# Altium project DriverBoard.PrjPcb
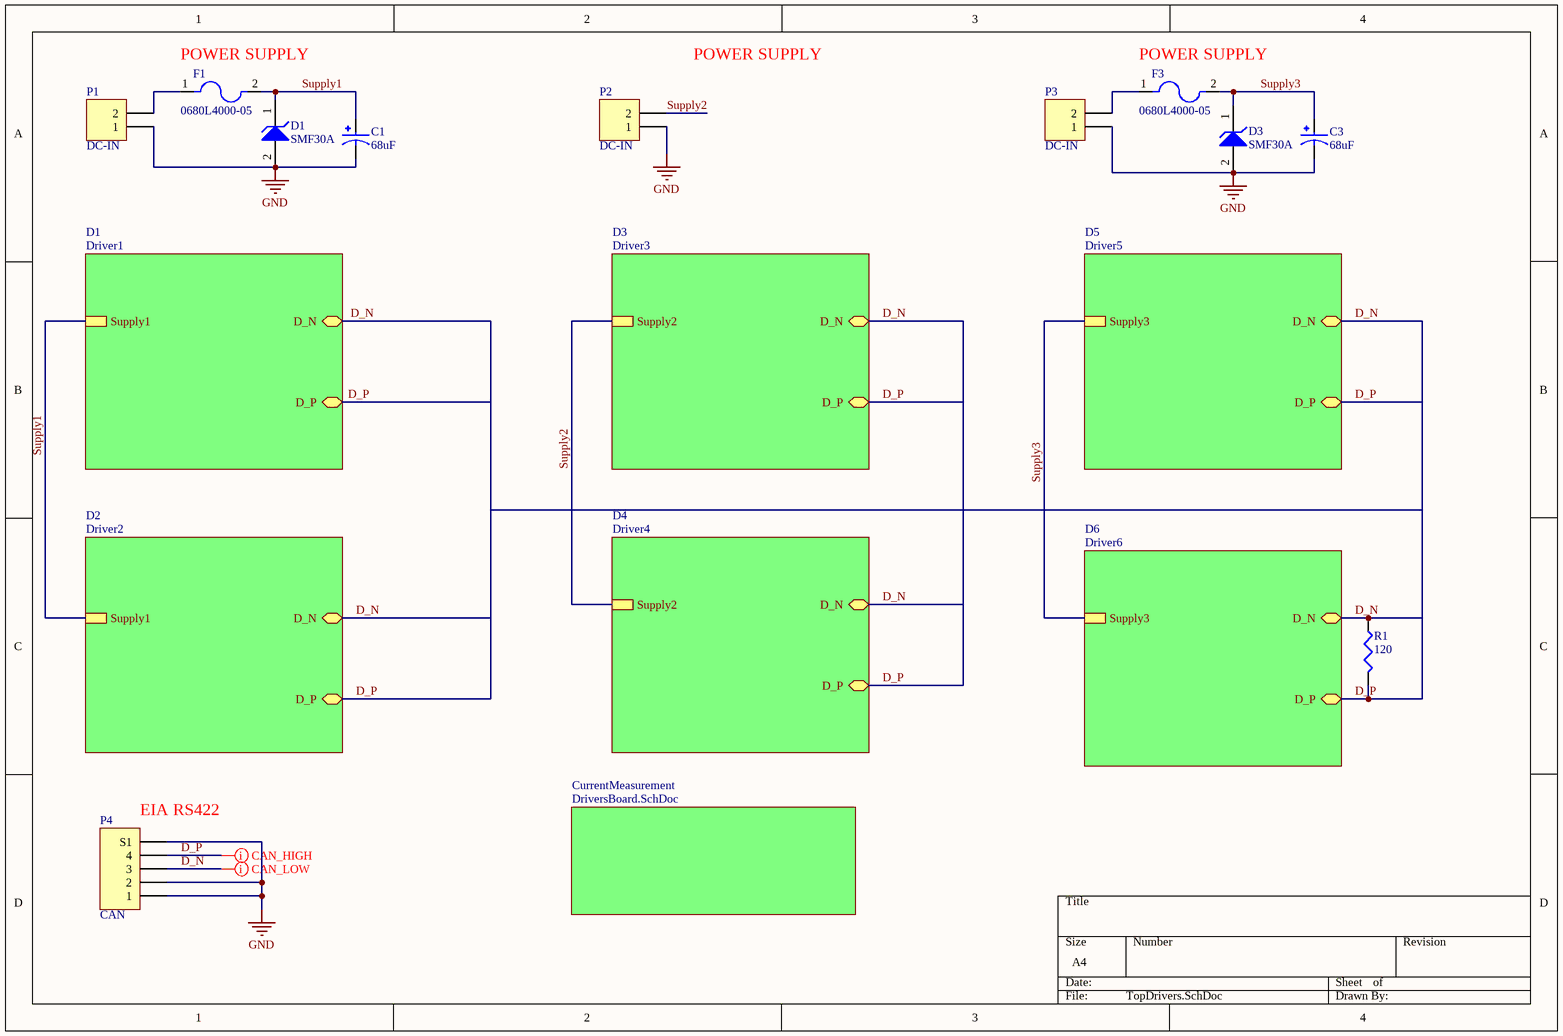
[diagram p0: TopDrivers.SchDoc]
8 sheets, 175 parts. Net scope: hierarchical (ports join the sheet entries above them; power ports are global).
Board files: DriversBoard_Bigger.PcbDoc, PCB1.PcbDoc, DriversBoard.PcbDoc
Sheets:
  TopDrivers.SchDoc
    CurrentMeasurement = DriversBoard.SchDoc
    D1 = Driver1.SchDoc
    D3 = Driver3.SchDoc
    D5 = Driver5.SchDoc
    D2 = Driver2.SchDoc
    D4 = Driver4.SchDoc
    D6 = Driver6.SchDoc

## Sheet TopDrivers.SchDoc
size A4; SheetNumber: 1; SheetTotal: 8

### Parts
C1  68uF  [CAP_50SVT68M]
C3  68uF  [CAP_50SVT68M]
D1  SMF30A  [ONSC-SOD-123FL-2-498_V]
D3  SMF30A  [ONSC-SOD-123FL-2-498_V]
F1  0680L4000-05  [FUSC6125X279N]
F3  0680L4000-05  [FUSC6125X279N]
P1  DC-IN  [MOLEX_1724480002]
P2  DC-IN  [MOLEX_1724480002]
P3  DC-IN  [MOLEX_1724480002]
P4  CAN  [MOLEX_5025850470]
R1  value 120  [J1-0603]  (hidden comment: Res3)

### Sub-sheets
CurrentMeasurement = DriversBoard.SchDoc: no entries
D1 = Driver1: Supply1, D_P (bidir), D_N (bidir)
D2 = Driver2: D_P (bidir), D_N (bidir), Supply1
D3 = Driver3: D_P (bidir), D_N (bidir), Supply2
D4 = Driver4: D_P (bidir), D_N (bidir), Supply2
D5 = Driver5: D_N (bidir), D_P (bidir), Supply3
D6 = Driver6: D_N (bidir), D_P (bidir), Supply3

### Nets
GND: C1.2 C3.2 D1.2(A) D3.2(A) P1.1 P2.1 P3.1 P4.1 P4.2 P4.S1
Supply1: C1.1 D1.1(K) F1.2 ; sheet D1/Supply1, sheet D2/Supply1
D_N: P4.3 R1.1 ; sheet D1/D_N, sheet D3/D_N, sheet D5/D_N, sheet D2/D_N, sheet D4/D_N, sheet D6/D_N
D_P: P4.4 R1.2 ; sheet D1/D_P, sheet D3/D_P, sheet D5/D_P, sheet D2/D_P, sheet D4/D_P, sheet D6/D_P
Supply2: P2.2 ; sheet D3/Supply2, sheet D4/Supply2
Supply3: C3.1 D3.1(K) F3.2 ; sheet D5/Supply3, sheet D6/Supply3
NetF1_1: F1.1 P1.2
NetF3_1: F3.1 P3.2

### Layout directives
differential pair; differential pair class *; net class *: D_N
differential pair: D_P

### Notes on the sheet
- (near F1) POWER SUPPLY
- POWER SUPPLY
- (near F3) POWER SUPPLY
- (near P4) EIA RS422

### Library data of the parts
C1 C3 = 50SVT68M: Package: None; MP: 50SVT68M; Price: None; Availability: Unavailable; Value: *
D1 D3 = SMF30AT1G: 200 W Transient Voltage Suppressor, 2-Pin SOD-123FL, Pb-Free, Tape and Reel; Manufacturer: On Semiconductor; Direction: Unidirectional; IR Max (uA): 1; V(BR) Typ (V): 35.1; DatasheetVersion: Rev. 7; PackageVersion: Rev. D, 05/2013; PackageReference: SOD-123FL-2-498; PackageDescription: 2-Pin SOD, Body 1.65 x 2.7 mm; Supplier 1: Digi-Key; Supplier Part Number 1: SMF30AT1GOSTR-ND; Supplier 2: Digi-Key; Supplier Part Number 2: SMF30AT1GOSCT-ND; Supplier 3: Digi-Key; Supplier Part Number 3: SMF30AT1GOSDKR-ND; Supplier 4: Farnell; Supplier Part Number 4: 2317489; Supplier 5: Newark; Supplier Part Number 5: 09R9720; Supplier 6: Newark; Supplier Part Number 6: 42K2628; Supplier 7: Mouser; Supplier Part Number 7: 863-SMF30AT1G; Packing: Tape and Reel; RoHS: Pb-Free; Mounting Technology: Surface Mount; PartNumber: SMF30AT1G; ComponentLink1Description: Manufacturer URL; ComponentLink1URL: http://www.onsemi.com/; ComponentLink2Description: Datasheet; ComponentLink2URL: http://www.onsemi.com/pub_link/Collateral/SMF5.0AT1-D.PDF; ComponentLink3Description: Package Specification; ComponentLink3URL: http://www.onsemi.com/pub_link/Collateral/498-01.PDF
F1 F3 = 0680L4000-05: Surface mount bricks | Silver Plated | 2410 case size | Slow Blow | 4A | Tape and Reel (5000 pcs.); MF: Bel Fuse; SnapEDA_Link: https://www.snapeda.com/parts/0680L4000-05/Bel+Fuse/view-part/?ref=snap; Purchase-URL: https://pricing.snapeda.com/search/part/0680L4000-05/?ref=eda; Availability: In Stock; MP: 0680L4000-05; Value: *; Price: None; Package: SMD-2 Bel Fuse Inc.; Check_prices: https://www.snapeda.com/parts/0680L4000-05/Bel+Fuse/view-part/?ref=eda
P1-P3 = Header 2: Header, 2-Pin; LatestRevisionDate: 17-Jul-2002; LatestRevisionNote: Re-released for DXP Platform.; Publisher: Altium Limited
P4 = Header 5: Header, 5-Pin; LatestRevisionDate: 17-Jul-2002; LatestRevisionNote: Re-released for DXP Platform.; Publisher: Altium Limited; Part Number: *
R1 = Res3: Resistor; Published: 8-Jun-2000; LatestRevisionDate: 29-May-2009; LatestRevisionNote: IPC-7351 Footprint Added.; PackageReference: J1-0603; Publisher: Altium Limited; PackageDescription: Chip Resistor

## Sheet DriversBoard.SchDoc: Power
size A4; CompanyName: SpaceBee Technologies; Organization: Open Space; Revision: 0; SheetNumber: 2; SheetTotal: 8; Mail: mgmt@spacebeetech.com; Project: Rovertito; ProjectName: Driver Board
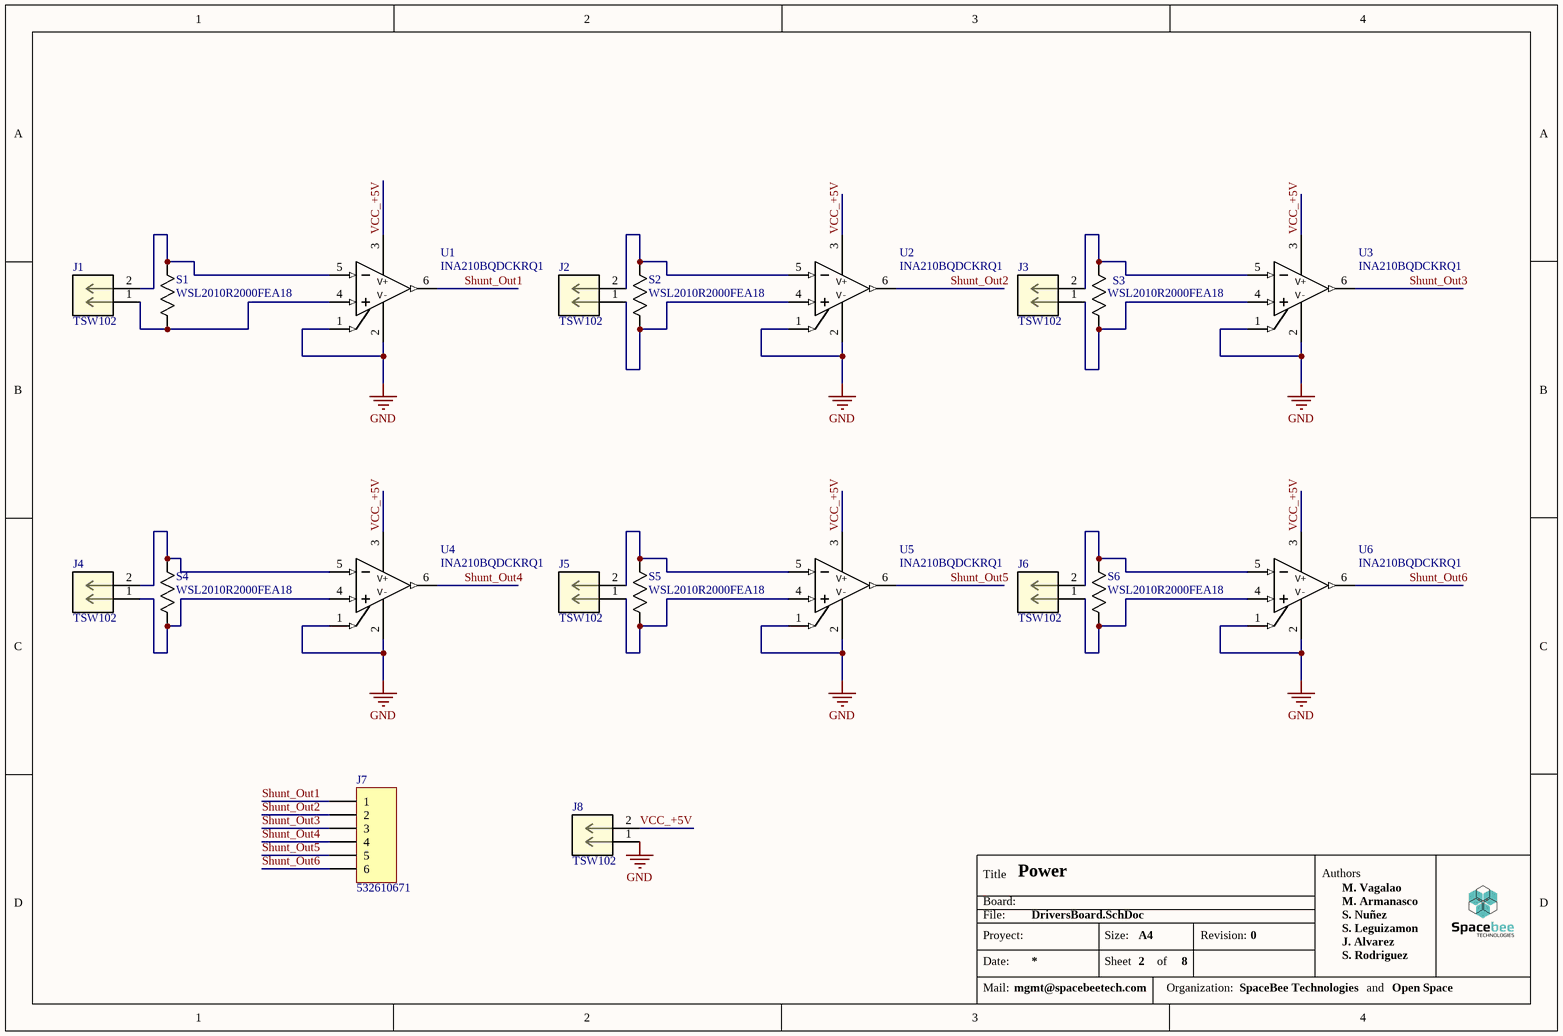
[diagram p1: DriversBoard.SchDoc]

### Parts
J1  TSW102  [MOLEX_53261-0271]
J2  TSW102  [MOLEX_53261-0271]
J3  TSW102  [MOLEX_53261-0271]
J4  TSW102  [MOLEX_53261-0271]
J5  TSW102  [MOLEX_53261-0271]
J6  TSW102  [MOLEX_53261-0271]
J7  532610671  [MOLEX_532610671]
J8  TSW102  [MOLEX_53261-0271]
S1  WSL2010R2000FEA18  [RC2010N_VIS-L]
S2  WSL2010R2000FEA18  [RC2010N_VIS-L]
S3  WSL2010R2000FEA18  [RC2010N_VIS-L]
S4  WSL2010R2000FEA18  [RC2010N_VIS-L]
S5  WSL2010R2000FEA18  [RC2010N_VIS-L]
S6  WSL2010R2000FEA18  [RC2010N_VIS-L]
U1  INA210BQDCKRQ1  [INA210BQDCKRQ1]
U2  INA210BQDCKRQ1  [INA210BQDCKRQ1]
U3  INA210BQDCKRQ1  [INA210BQDCKRQ1]
U4  INA210BQDCKRQ1  [INA210BQDCKRQ1]
U5  INA210BQDCKRQ1  [INA210BQDCKRQ1]
U6  INA210BQDCKRQ1  [INA210BQDCKRQ1]

### Nets
GND: J8.1 U1.1(REF) U1.2(GND) U2.1(REF) U2.2(GND) U3.1(REF) U3.2(GND) U4.1(REF) U4.2(GND) U5.1(REF) U5.2(GND) U6.1(REF) U6.2(GND)
Shunt_Out1: J7.1 U1.6(OUT)
Shunt_Out2: J7.2 U2.6(OUT)
Shunt_Out3: J7.3 U3.6(OUT)
Shunt_Out4: J7.4 U4.6(OUT)
Shunt_Out5: J7.5 U5.6(OUT)
Shunt_Out6: J7.6 U6.6(OUT)
VCC_+5V: J8.2 U1.3(V+) U2.3(V+) U3.3(V+) U4.3(V+) U5.3(V+) U6.3(V+)
NetJ1_1: J1.1 S1.2 U1.4(IN+)
NetJ1_2: J1.2 S1.1 U1.5(IN-)
NetJ2_1: J2.1 S2.2 U2.4(IN+)
NetJ2_2: J2.2 S2.1 U2.5(IN-)
NetJ3_1: J3.1 S3.2 U3.4(IN+)
NetJ3_2: J3.2 S3.1 U3.5(IN-)
NetJ4_1: J4.1 S4.2 U4.4(IN+)
NetJ4_2: J4.2 S4.1 U4.5(IN-)
NetJ5_1: J5.1 S5.2 U5.4(IN+)
NetJ5_2: J5.2 S5.1 U5.5(IN-)
NetJ6_1: J6.1 S6.2 U6.4(IN+)
NetJ6_2: J6.2 S6.1 U6.5(IN-)

### Notes on the sheet
- Title
- Board:
- File:
- Authors
- M. Armanasco
- S. Nuñez
- M. Vagalao
- Proyect:
- Date:
- Mail:
- Size:
- Sheet
- A4
- of
- Organization:
- Revision:
- S. Rodriguez
- S. Leguizamon
- J. Alvarez
- and
- (in symbol INA210BQDCKRQ1) V-

### Library data of the parts
S1-S6 = WSL2010R2000FEA18: No Description Available; Mfr_Name: Vishay; Copyright: Copyright (C) 2022 Ultra Librarian. All rights reserved.; Manufacturer_Part_Number: WSL2010R2000FEA18; RefDes: RefDes; Type: DEV
U1-U6 = INA210BQDCKRQ1: Part Number: 296-44263-2-ND
J7 = 532610671: LatestRevisionDate: 17-Jul-2002; LatestRevisionNote: Re-released for DXP Platform.; Publisher: Altium Limited

## Sheet Driver1.SchDoc
size A4; SheetNumber: 3; SheetTotal: 8
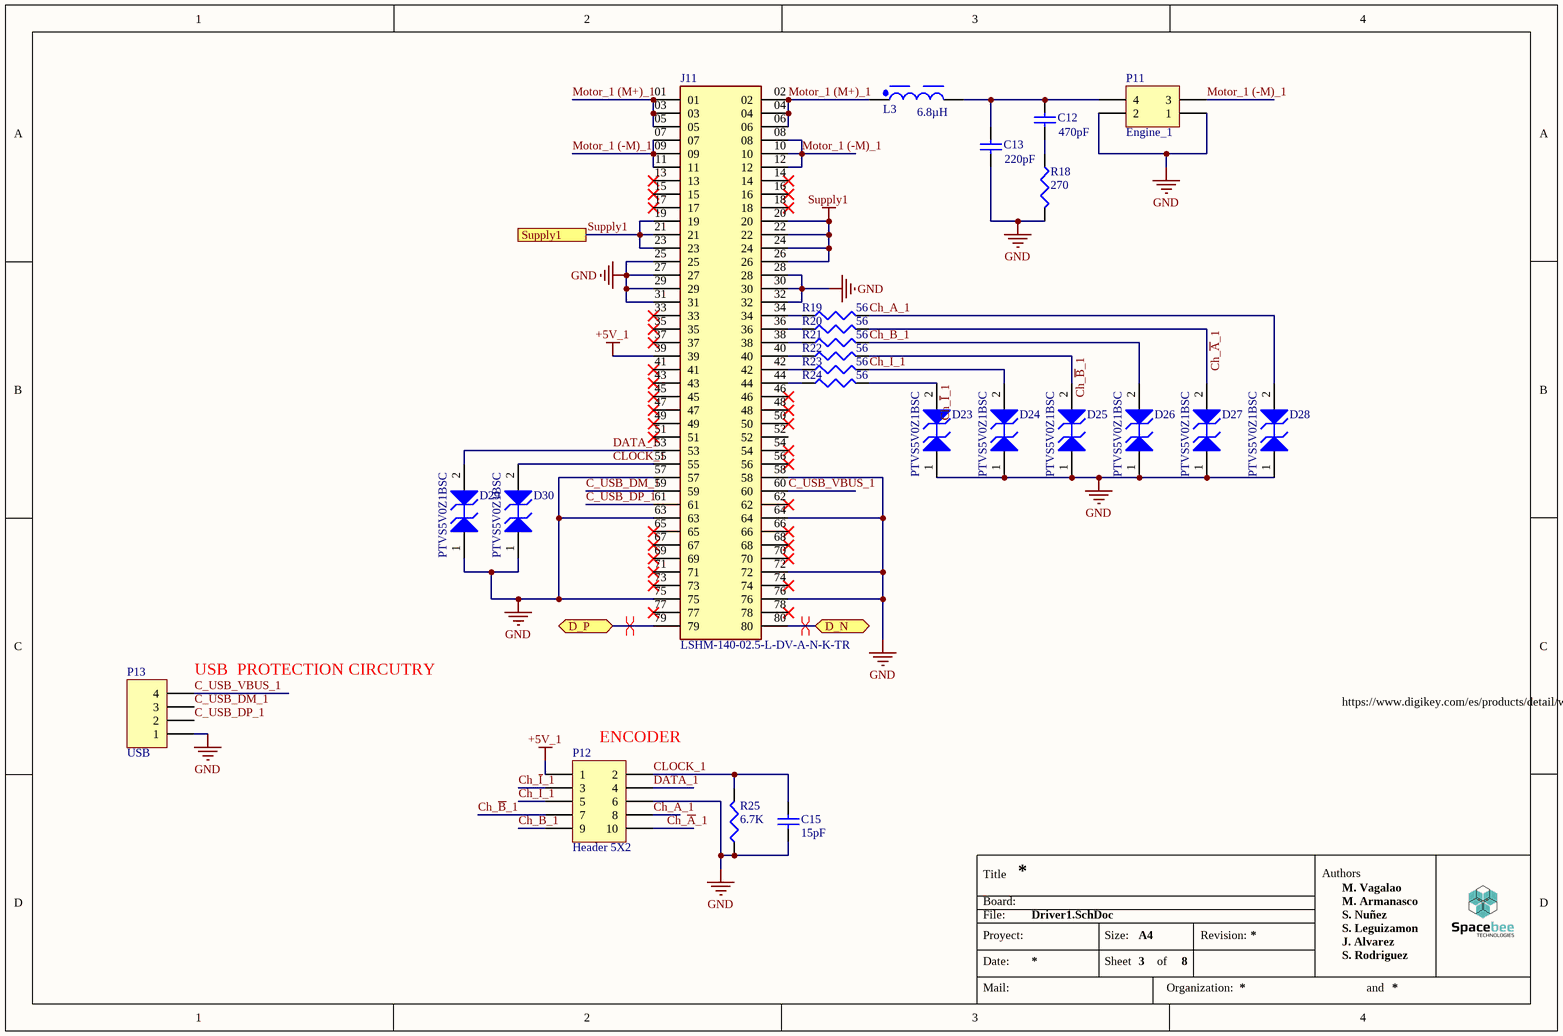
[diagram p2: Driver1.SchDoc]

### Parts
C12  value 470pF  [1608[0603]]  (hidden comment: Cap Semi)
C13  value 220pF  [1608[0603]]  (hidden comment: Cap Semi)
C15  value 15pF  [6-0805_L]  (hidden comment: Cap Semi)
D23  PTVS5V0Z1BSC  [SOD993B]
D24  PTVS5V0Z1BSC  [SOD993B]
D25  PTVS5V0Z1BSC  [SOD993B]
D26  PTVS5V0Z1BSC  [SOD993B]
D27  PTVS5V0Z1BSC  [SOD993B]
D28  PTVS5V0Z1BSC  [SOD993B]
D29  PTVS5V0Z1BSC  [SOD993B]
D30  PTVS5V0Z1BSC  [SOD993B]
J11  LSHM-140-02.5-L-DV-A-N-K-TR  [SAMTEC_LSHM-140-02.5-L-DV-A-N-K-TR]
L3  6.8µH  [WE-XHMA_6060]
P11  Engine_1  [MOLEX_1724480004]
P12  Header 5X2  [CONN_HIF3FC-14PA-2.54DS(71)_HIR]
P13  USB  [Header 4 SMD]
R18  value 270  [J1-0603]  (hidden comment: Res3)
R19  value 56  [J1-0603]  (hidden comment: Res3)
R20  value 56  [J1-0603]  (hidden comment: Res3)
R21  value 56  [J1-0603]  (hidden comment: Res3)
R22  value 56  [J1-0603]  (hidden comment: Res3)
R23  value 56  [J1-0603]  (hidden comment: Res3)
R24  value 56  [J1-0603]  (hidden comment: Res3)
R25  value 6.7K  [J1-0603]  (hidden comment: Res3)

### Ports
D_N (bidir), D_P (bidir), Supply1

### Nets
+5V_1: J11.39 P12.1
GND: C13.2 C15.1 D23.1(A1) D24.1(A1) D25.1(A1) D26.1(A1) D27.1(A1) D28.1(A1) D29.1(A1) D30.1(A1) J11.25 J11.27 J11.28 J11.29 J11.30 J11.31 J11.32 J11.57 J11.58 J11.63 J11.64 J11.72 J11.75 J11.76 P11.1 P11.2 P12.6 P13.1 R18.2 R25.1
Supply1: J11.19 J11.20 J11.21 J11.22 J11.23 J11.24 J11.26 ; port Supply1
C_USB_DM_1: J11.59 P13.3
C_USB_DP_1: J11.61 P13.2
C_USB_VBUS_1: J11.60 P13.4
Ch_~{A}_1: D27.2(A2) P12.10 R20.2
Ch_A_1: D28.2(A2) P12.8 R19.2
Ch_~{B}_1: D25.2(A2) P12.7 R22.2
Ch_B_1: D26.2(A2) P12.9 R21.2
Ch_~{I}_1: D23.2(A2) P12.3 R24.2
Ch_I_1: D24.2(A2) P12.5 R23.2
CLOCK_1: C15.2 D30.2(A2) J11.55 P12.2 R25.2
D_N: J11.80 ; port D_N
D_P: J11.79 ; port D_P
DATA_1: D29.2(A2) J11.53 P12.4
Motor_1 (-M)_1: J11.07 J11.08 J11.09 J11.10 J11.11 J11.12 P11.3
Motor_1 (M+)_1: J11.01 J11.02 J11.03 J11.04 J11.05 J11.06 L3.1
NetC12_1: C12.1 C13.1 L3.2 P11.4
NetC12_2: C12.2 R18.1
NetJ11_34: J11.34 R19.1
NetJ11_36: J11.36 R20.1
NetJ11_38: J11.38 R21.1
NetJ11_40: J11.40 R22.1
NetJ11_42: J11.42 R23.1
NetJ11_44: J11.44 R24.1

Not connected (* = marked no-connect by the designer): J11 13* 14* 15* 16* 17* 18* 33* 35* 37* 41* 43* 45* 46* 47* 48* 49* 50* 51* 52 54* 56* 62* 65* 66* 67* 68* 69* 70* 71* 73* 74* 77* 78*

### Layout directives
differential pair: D_N, D_P

### Notes on the sheet
- (near P13) USB  PROTECTION CIRCUTRY
- (near P12) ENCODER
- https://www.digikey.com/es/products/detail/würth-elektronik/9774050243R/5320640?s=N4IgTCBcDaIJwHYEBYAMBWVZkGYBKIAugL5A
- Title
- Board:
- File:
- Authors
- M. Armanasco
- S. Nuñez
- M. Vagalao
- Proyect:
- Date:
- Mail:
- Size:
- Sheet
- A4
- of
- Organization:
- Revision:
- S. Rodriguez
- S. Leguizamon
- J. Alvarez
- and

### Library data of the parts
C12 C13 = Cap Semi: Capacitor (Semiconductor SIM Model); Published: 8-Jun-2000; LatestRevisionDate: 29-May-2009; LatestRevisionNote: IPC-7351 Footprint Added.; PackageReference: C1206; Publisher: Altium Limited; PackageDescription: Chip Capacitor
C15 = Cap 0805: Capacitor (Semiconductor SIM Model); Published: 8-Jun-2000; LatestRevisionDate: 29-May-2009; LatestRevisionNote: IPC-7351 Footprint Added.; PackageReference: C1206; Publisher: Altium Limited; PackageDescription: Chip Capacitor
D23-D30 = PTVS5V0Z1BSC: Manufacturer: On Semiconductor; PartNumber: 1SMB16CAT3; Direction: Bidirectional; IR Max (uA): 5; Packing: Tape and Reel; PPK Max (W): 600; V(BR) Typ (V): 18.74; DatasheetVersion: Rev. A; PackageVersion: Rev. A, 01/2000; PackageReference: SMB-2-403C-01; PackageDescription: 2-Pin Small Molded Package, J-Bend Lead, Body 4.315 x 3.555 mm; Supplier 1: Digi-Key; Supplier Part Number 1: 1SMB16CAT3OSTR-ND; Supplier 2: Digi-Key; Supplier Part Number 2: 1SMB16CAT3OSCT-ND; Supplier 3: Digi-Key; Supplier Part Number 3: 1SMB16CAT3OSDKR-ND; Mounting Technology: Surface Mount; ComponentLink1Description: Manufacturer URL; ComponentLink1URL: http://www.onsemi.com/; ComponentLink2Description: Datasheet; ComponentLink2URL: http://www.onsemi.com/pub_link/Collateral/1SMB10CAT3-D.PDF; ComponentLink3Description: Package Specification; ComponentLink3URL: http://www.onsemi.com/pub_link/Collateral/1SMB10CAT3-D.PDF
J11 = LSHM-140-02.5-L-DV-A-N-K-TR: LSHM - Samtec 0.50mm Razor Beam High-Speed Hermaphroditic Terminal / Socket Strip.; Price: None; MP: LSHM-140-02.5-L-DV-A-N-K-TR; Availability: Unavailable; Value: *; Package: None
L3 = 78439369068: WE-XHMA SMD Power Inductor, size 1090, 6.8µH, 10.5A, 7.16mΩ; Manufacturer: Wurth Elektronik; Case/Size Code: 1090; Inductance Tolerance: 20%; Saturation Current: 23.25A; Self Resonant Frequency: 16MHz; ComponentLink1Description: Website Link; ComponentLink1URL: https://www.we-online.com/redexpert/article/78439369068?ad; ComponentLink2Description: Datasheet Link; ComponentLink2URL: https://www.we-online.com/redexpert/spec/78439369068?ad; Manufacturer Part Number: 78439369068; Category: Shielded Power Inductors; Match Code: WE-XHMA; Mount: Surface Mount; Operating Temperature Max: 125°C; Operating Temperature Min: -40°C; Packaging: Tape and Reel; Length: 11.6mm; Width: 10.5mm; Height: 8.8mm; DC Resistance: 7.16mΩ; Inductance: 6.8µH; Rated Current: 10.5A
P11 = Header 2X2: Header, 2-Pin, Dual row; LatestRevisionDate: 17-Jul-2002; LatestRevisionNote: Re-released for DXP Platform.; Publisher: Altium Limited
P12 = Header 5X2: Header, 5-Pin, Dual row; LatestRevisionDate: 17-Jul-2002; LatestRevisionNote: Re-released for DXP Platform.; Publisher: Altium Limited
P13 = Header 4 SMD: Header, 4-Pin; LatestRevisionDate: 17-Jul-2002; LatestRevisionNote: Re-released for DXP Platform.; Publisher: Altium Limited
R18-R25 = Res3: Resistor; Published: 8-Jun-2000; LatestRevisionDate: 29-May-2009; LatestRevisionNote: IPC-7351 Footprint Added.; PackageReference: J1-0603; Publisher: Altium Limited; PackageDescription: Chip Resistor

## Sheet Driver3.SchDoc
size A4; SheetNumber: 5; SheetTotal: 8
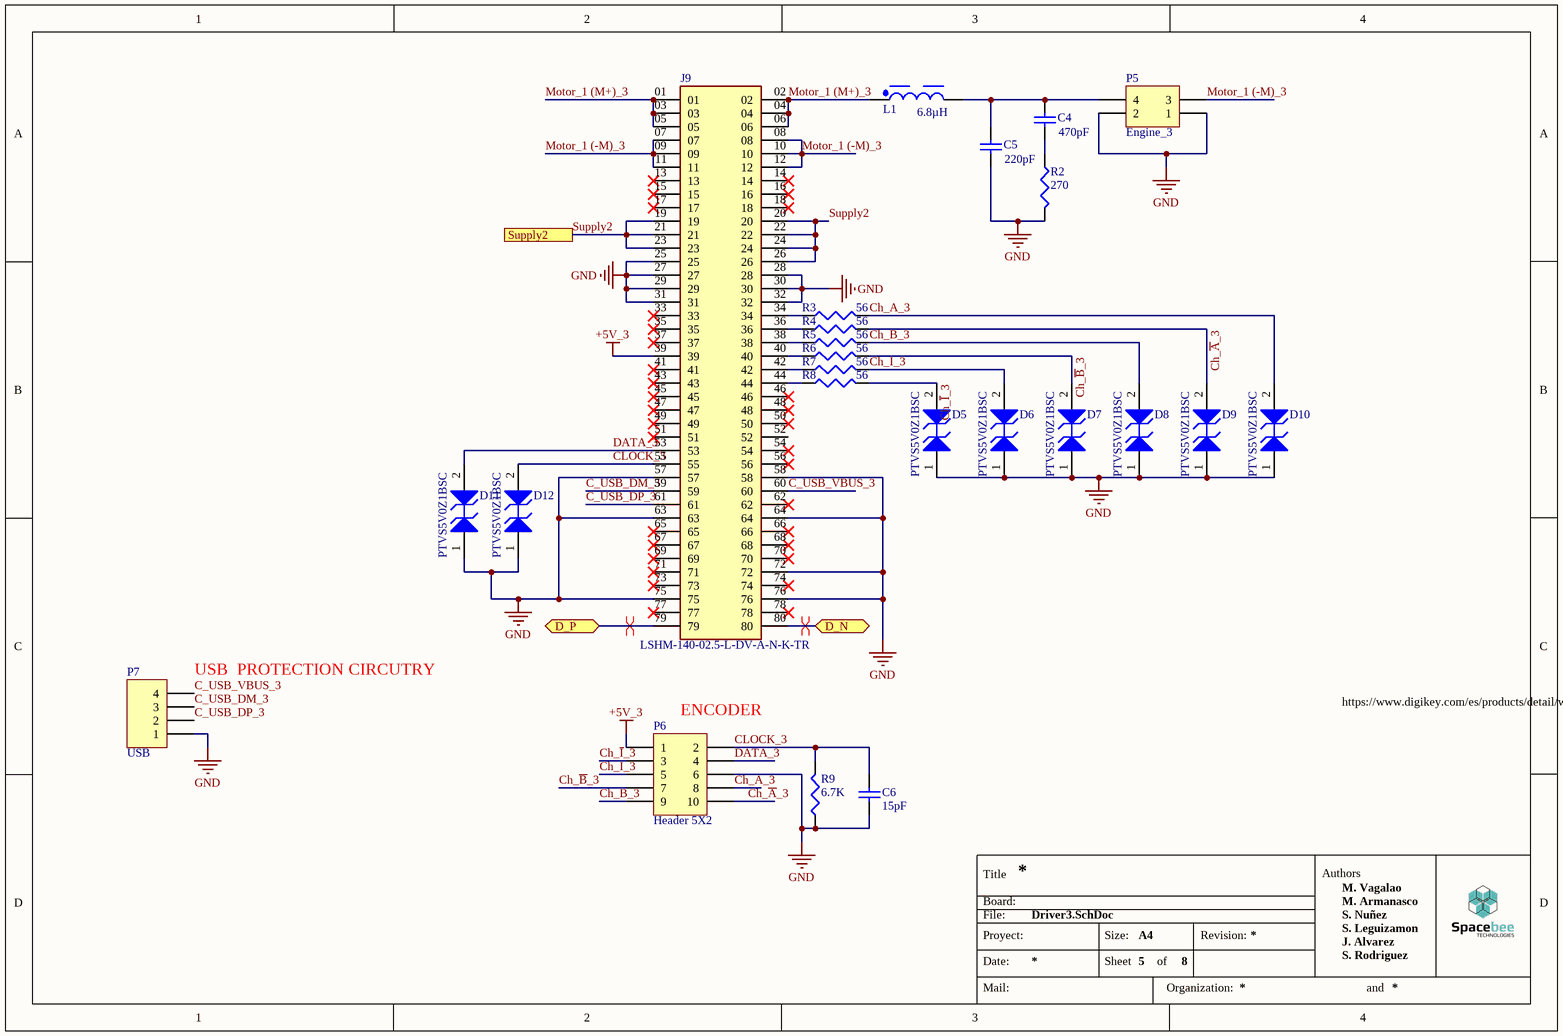
[diagram p3: Driver3.SchDoc]

### Parts
C4  value 470pF  [1608[0603]]  (hidden comment: Cap Semi)
C5  value 220pF  [1608[0603]]  (hidden comment: Cap Semi)
C6  value 15pF  [6-0805_L]  (hidden comment: Cap Semi)
D5  PTVS5V0Z1BSC  [SOD993B]
D6  PTVS5V0Z1BSC  [SOD993B]
D7  PTVS5V0Z1BSC  [SOD993B]
D8  PTVS5V0Z1BSC  [SOD993B]
D9  PTVS5V0Z1BSC  [SOD993B]
D10  PTVS5V0Z1BSC  [SOD993B]
D11  PTVS5V0Z1BSC  [SOD993B]
D12  PTVS5V0Z1BSC  [SOD993B]
J9  LSHM-140-02.5-L-DV-A-N-K-TR  [SAMTEC_LSHM-140-02.5-L-DV-A-N-K-TR]
L1  6.8µH  [WE-XHMA_6060]
P5  Engine_3  [MOLEX_1724480004]
P6  Header 5X2  [CONN_HIF3FC-14PA-2.54DS(71)_HIR]
P7  USB  [Header 4 SMD]
R2  value 270  [J1-0603]  (hidden comment: Res3)
R3  value 56  [J1-0603]  (hidden comment: Res3)
R4  value 56  [J1-0603]  (hidden comment: Res3)
R5  value 56  [J1-0603]  (hidden comment: Res3)
R6  value 56  [J1-0603]  (hidden comment: Res3)
R7  value 56  [J1-0603]  (hidden comment: Res3)
R8  value 56  [J1-0603]  (hidden comment: Res3)
R9  value 6.7K  [J1-0603]  (hidden comment: Res3)

### Ports
D_N (bidir), D_P (bidir), Supply2

### Nets
+5V_3: J9.39 P6.1
GND: C5.2 C6.1 D5.1(A1) D6.1(A1) D7.1(A1) D8.1(A1) D9.1(A1) D10.1(A1) D11.1(A1) D12.1(A1) J9.25 J9.27 J9.28 J9.29 J9.30 J9.31 J9.32 J9.57 J9.58 J9.63 J9.64 J9.72 J9.75 J9.76 P5.1 P5.2 P6.6 P7.1 R2.2 R9.1
C_USB_DM_3: J9.59 P7.3
C_USB_DP_3: J9.61 P7.2
C_USB_VBUS_3: J9.60 P7.4
Ch_~{A}_3: D9.2(A2) P6.10 R4.2
Ch_A_3: D10.2(A2) P6.8 R3.2
Ch_~{B}_3: D7.2(A2) P6.7 R6.2
Ch_B_3: D8.2(A2) P6.9 R5.2
Ch_~{I}_3: D5.2(A2) P6.3 R8.2
Ch_I_3: D6.2(A2) P6.5 R7.2
CLOCK_3: C6.2 D12.2(A2) J9.55 P6.2 R9.2
D_N: J9.80 ; port D_N
D_P: J9.79 ; port D_P
DATA_3: D11.2(A2) J9.53 P6.4
Motor_1 (-M)_3: J9.07 J9.08 J9.09 J9.10 J9.11 J9.12 P5.3
Motor_1 (M+)_3: J9.01 J9.02 J9.03 J9.04 J9.05 J9.06 L1.1
Supply2: J9.19 J9.20 J9.21 J9.22 J9.23 J9.24 J9.26 ; port Supply2
NetC4_1: C4.1 C5.1 L1.2 P5.4
NetC4_2: C4.2 R2.1
NetJ9_34: J9.34 R3.1
NetJ9_36: J9.36 R4.1
NetJ9_38: J9.38 R5.1
NetJ9_40: J9.40 R6.1
NetJ9_42: J9.42 R7.1
NetJ9_44: J9.44 R8.1

Not connected (* = marked no-connect by the designer): J9 13* 14* 15* 16* 17* 18* 33* 35* 37* 41* 43* 45* 46* 47* 48* 49* 50* 51* 52 54* 56* 62* 65* 66* 67* 68* 69* 70* 71* 73* 74* 77* 78*

### Layout directives
differential pair: D_N, D_P

### Notes on the sheet
- (near P7) USB  PROTECTION CIRCUTRY
- (near P6) ENCODER
- https://www.digikey.com/es/products/detail/würth-elektronik/9774050243R/5320640?s=N4IgTCBcDaIJwHYEBYAMBWVZkGYBKIAugL5A
- Title
- Board:
- File:
- Authors
- M. Armanasco
- S. Nuñez
- M. Vagalao
- Proyect:
- Date:
- Mail:
- Size:
- Sheet
- A4
- of
- Organization:
- Revision:
- S. Rodriguez
- S. Leguizamon
- J. Alvarez
- and

### Library data of the parts
C4 C5 = Cap Semi: Capacitor (Semiconductor SIM Model); Published: 8-Jun-2000; LatestRevisionDate: 29-May-2009; LatestRevisionNote: IPC-7351 Footprint Added.; PackageReference: C1206; Publisher: Altium Limited; PackageDescription: Chip Capacitor
C6 = Cap 0805: Capacitor (Semiconductor SIM Model); Published: 8-Jun-2000; LatestRevisionDate: 29-May-2009; LatestRevisionNote: IPC-7351 Footprint Added.; PackageReference: C1206; Publisher: Altium Limited; PackageDescription: Chip Capacitor
D5-D12 = PTVS5V0Z1BSC: as D23 on sheet Driver1; DatasheetVersion: Rev. A; PackageVersion: Rev. A, 01/2000; PackageReference: SMB-2-403C-01; PackageDescription: 2-Pin Small Molded Package, J-Bend Lead, Body 4.315 x 3.555 mm; Supplier 1: Digi-Key; Supplier Part Number 1: 1SMB16CAT3OSTR-ND; Supplier 2: Digi-Key; Supplier Part Number 2: 1SMB16CAT3OSCT-ND; Supplier 3: Digi-Key; Supplier Part Number 3: 1SMB16CAT3OSDKR-ND; Mounting Technology: Surface Mount; ComponentLink1Description: Manufacturer URL; ComponentLink1URL: http://www.onsemi.com/; ComponentLink2Description: Datasheet; ComponentLink2URL: http://www.onsemi.com/pub_link/Collateral/1SMB10CAT3-D.PDF; ComponentLink3Description: Package Specification; ComponentLink3URL: http://www.onsemi.com/pub_link/Collateral/1SMB10CAT3-D.PDF
J9 = LSHM-140-02.5-L-DV-A-N-K-TR: as J11 on sheet Driver1; Price: None; MP: LSHM-140-02.5-L-DV-A-N-K-TR; Availability: Unavailable; Value: *; Package: None
L1 = 78439369068: as L3 on sheet Driver1; ComponentLink1Description: Website Link; ComponentLink1URL: https://www.we-online.com/redexpert/article/78439369068?ad; ComponentLink2Description: Datasheet Link; ComponentLink2URL: https://www.we-online.com/redexpert/spec/78439369068?ad; Manufacturer Part Number: 78439369068; Category: Shielded Power Inductors; Match Code: WE-XHMA; Mount: Surface Mount; Operating Temperature Max: 125°C; Operating Temperature Min: -40°C; Packaging: Tape and Reel; Length: 11.6mm; Width: 10.5mm; Height: 8.8mm; DC Resistance: 7.16mΩ; Inductance: 6.8µH; Rated Current: 10.5A
P5 = Header 2X2: Header, 2-Pin, Dual row; LatestRevisionDate: 17-Jul-2002; LatestRevisionNote: Re-released for DXP Platform.; Publisher: Altium Limited
P6 = Header 5X2: Header, 5-Pin, Dual row; LatestRevisionDate: 17-Jul-2002; LatestRevisionNote: Re-released for DXP Platform.; Publisher: Altium Limited
P7 = Header 4 SMD: Header, 4-Pin; LatestRevisionDate: 17-Jul-2002; LatestRevisionNote: Re-released for DXP Platform.; Publisher: Altium Limited
R2-R9 = Res3: Resistor; Published: 8-Jun-2000; LatestRevisionDate: 29-May-2009; LatestRevisionNote: IPC-7351 Footprint Added.; PackageReference: J1-0603; Publisher: Altium Limited; PackageDescription: Chip Resistor

## Sheet Driver5.SchDoc
size A4; SheetNumber: 7; SheetTotal: 8
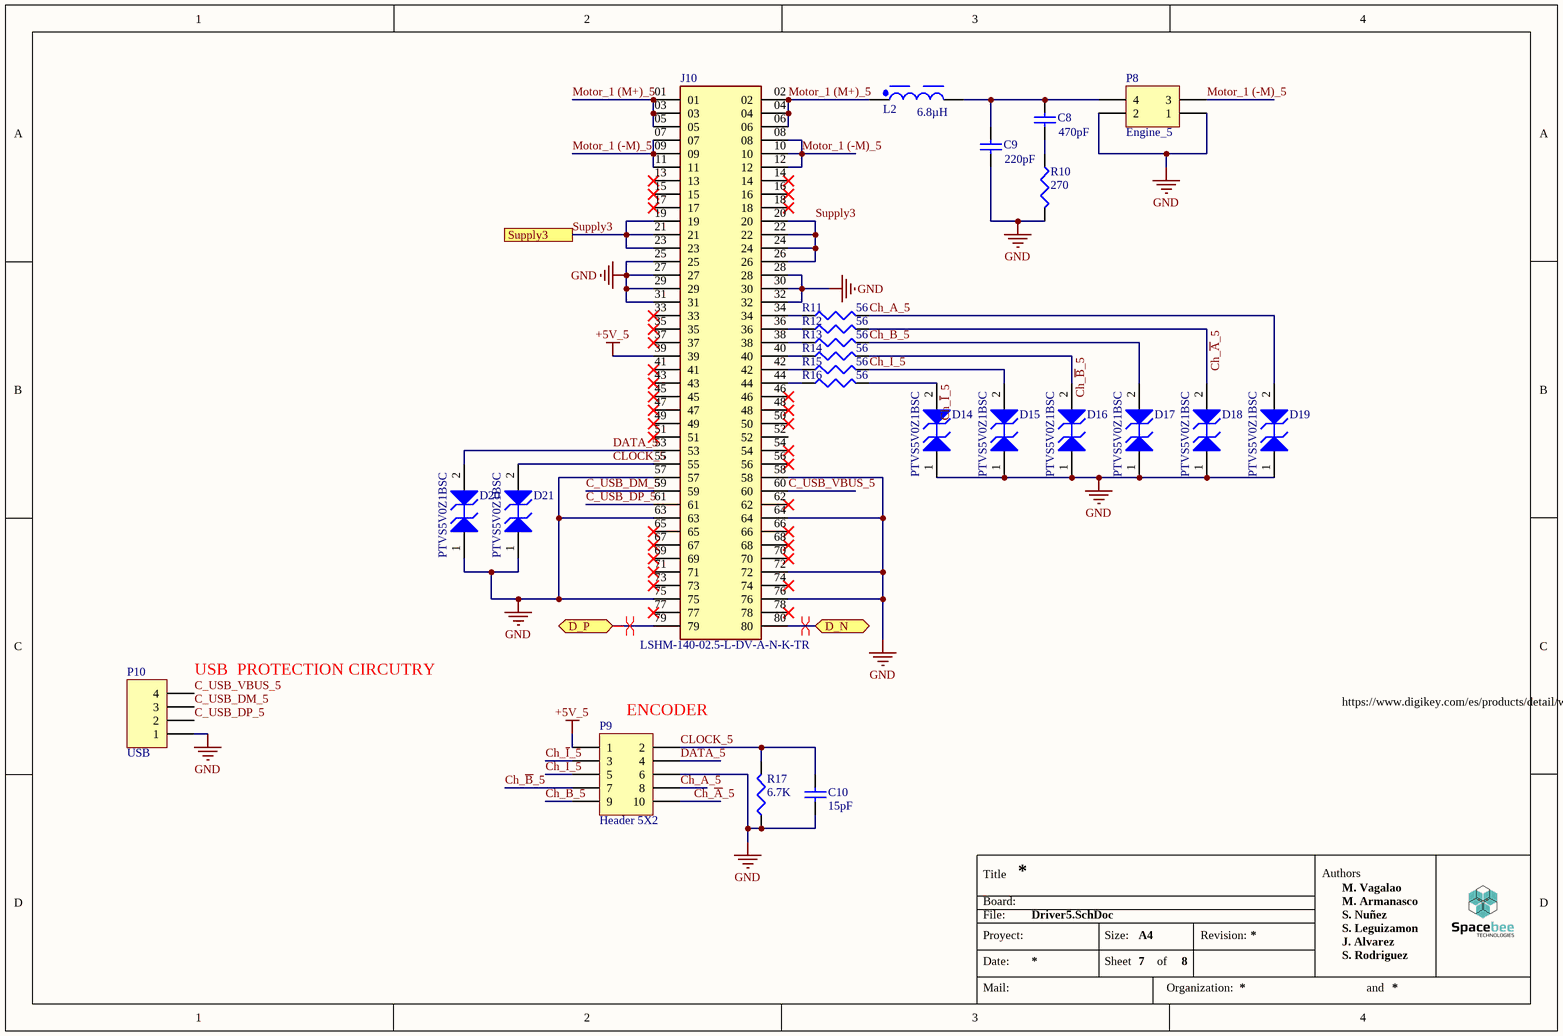
[diagram p4: Driver5.SchDoc]

### Parts
C8  value 470pF  [1608[0603]]  (hidden comment: Cap Semi)
C9  value 220pF  [1608[0603]]  (hidden comment: Cap Semi)
C10  value 15pF  [6-0805_L]  (hidden comment: Cap Semi)
D14  PTVS5V0Z1BSC  [SOD993B]
D15  PTVS5V0Z1BSC  [SOD993B]
D16  PTVS5V0Z1BSC  [SOD993B]
D17  PTVS5V0Z1BSC  [SOD993B]
D18  PTVS5V0Z1BSC  [SOD993B]
D19  PTVS5V0Z1BSC  [SOD993B]
D20  PTVS5V0Z1BSC  [SOD993B]
D21  PTVS5V0Z1BSC  [SOD993B]
J10  LSHM-140-02.5-L-DV-A-N-K-TR  [SAMTEC_LSHM-140-02.5-L-DV-A-N-K-TR]
L2  6.8µH  [WE-XHMA_6060]
P8  Engine_5  [MOLEX_1724480004]
P9  Header 5X2  [CONN_HIF3FC-14PA-2.54DS(71)_HIR]
P10  USB  [Header 4 SMD]
R10  value 270  [J1-0603]  (hidden comment: Res3)
R11  value 56  [J1-0603]  (hidden comment: Res3)
R12  value 56  [J1-0603]  (hidden comment: Res3)
R13  value 56  [J1-0603]  (hidden comment: Res3)
R14  value 56  [J1-0603]  (hidden comment: Res3)
R15  value 56  [J1-0603]  (hidden comment: Res3)
R16  value 56  [J1-0603]  (hidden comment: Res3)
R17  value 6.7K  [J1-0603]  (hidden comment: Res3)

### Ports
D_N (bidir), D_P (bidir), Supply3

### Nets
+5V_5: J10.39 P9.1
GND: C9.2 C10.1 D14.1(A1) D15.1(A1) D16.1(A1) D17.1(A1) D18.1(A1) D19.1(A1) D20.1(A1) D21.1(A1) J10.25 J10.27 J10.28 J10.29 J10.30 J10.31 J10.32 J10.57 J10.58 J10.63 J10.64 J10.72 J10.75 J10.76 P8.1 P8.2 P9.6 P10.1 R10.2 R17.1
C_USB_DM_5: J10.59 P10.3
C_USB_DP_5: J10.61 P10.2
C_USB_VBUS_5: J10.60 P10.4
Ch_~{A}_5: D18.2(A2) P9.10 R12.2
Ch_A_5: D19.2(A2) P9.8 R11.2
Ch_~{B}_5: D16.2(A2) P9.7 R14.2
Ch_B_5: D17.2(A2) P9.9 R13.2
Ch_~{I}_5: D14.2(A2) P9.3 R16.2
Ch_I_5: D15.2(A2) P9.5 R15.2
CLOCK_5: C10.2 D21.2(A2) J10.55 P9.2 R17.2
D_N: J10.80 ; port D_N
D_P: J10.79 ; port D_P
DATA_5: D20.2(A2) J10.53 P9.4
Motor_1 (-M)_5: J10.07 J10.08 J10.09 J10.10 J10.11 J10.12 P8.3
Motor_1 (M+)_5: J10.01 J10.02 J10.03 J10.04 J10.05 J10.06 L2.1
Supply3: J10.19 J10.20 J10.21 J10.22 J10.23 J10.24 J10.26 ; port Supply3
NetC8_1: C8.1 C9.1 L2.2 P8.4
NetC8_2: C8.2 R10.1
NetJ10_34: J10.34 R11.1
NetJ10_36: J10.36 R12.1
NetJ10_38: J10.38 R13.1
NetJ10_40: J10.40 R14.1
NetJ10_42: J10.42 R15.1
NetJ10_44: J10.44 R16.1

Not connected (* = marked no-connect by the designer): J10 13* 14* 15* 16* 17* 18* 33* 35* 37* 41* 43* 45* 46* 47* 48* 49* 50* 51* 52 54* 56* 62* 65* 66* 67* 68* 69* 70* 71* 73* 74* 77* 78*

### Layout directives
differential pair: D_N, D_P

### Notes on the sheet
- (near P10) USB  PROTECTION CIRCUTRY
- (near P9) ENCODER
- https://www.digikey.com/es/products/detail/würth-elektronik/9774050243R/5320640?s=N4IgTCBcDaIJwHYEBYAMBWVZkGYBKIAugL5A
- Title
- Board:
- File:
- Authors
- M. Armanasco
- S. Nuñez
- M. Vagalao
- Proyect:
- Date:
- Mail:
- Size:
- Sheet
- A4
- of
- Organization:
- Revision:
- S. Rodriguez
- S. Leguizamon
- J. Alvarez
- and

### Library data of the parts
C8 C9 = Cap Semi: Capacitor (Semiconductor SIM Model); Published: 8-Jun-2000; LatestRevisionDate: 29-May-2009; LatestRevisionNote: IPC-7351 Footprint Added.; PackageReference: C1206; Publisher: Altium Limited; PackageDescription: Chip Capacitor
C10 = Cap 0805: Capacitor (Semiconductor SIM Model); Published: 8-Jun-2000; LatestRevisionDate: 29-May-2009; LatestRevisionNote: IPC-7351 Footprint Added.; PackageReference: C1206; Publisher: Altium Limited; PackageDescription: Chip Capacitor
D14-D21 = PTVS5V0Z1BSC: as D23 on sheet Driver1; DatasheetVersion: Rev. A; PackageVersion: Rev. A, 01/2000; PackageReference: SMB-2-403C-01; PackageDescription: 2-Pin Small Molded Package, J-Bend Lead, Body 4.315 x 3.555 mm; Supplier 1: Digi-Key; Supplier Part Number 1: 1SMB16CAT3OSTR-ND; Supplier 2: Digi-Key; Supplier Part Number 2: 1SMB16CAT3OSCT-ND; Supplier 3: Digi-Key; Supplier Part Number 3: 1SMB16CAT3OSDKR-ND; Mounting Technology: Surface Mount; ComponentLink1Description: Manufacturer URL; ComponentLink1URL: http://www.onsemi.com/; ComponentLink2Description: Datasheet; ComponentLink2URL: http://www.onsemi.com/pub_link/Collateral/1SMB10CAT3-D.PDF; ComponentLink3Description: Package Specification; ComponentLink3URL: http://www.onsemi.com/pub_link/Collateral/1SMB10CAT3-D.PDF
J10 = LSHM-140-02.5-L-DV-A-N-K-TR: as J11 on sheet Driver1; Price: None; MP: LSHM-140-02.5-L-DV-A-N-K-TR; Availability: Unavailable; Value: *; Package: None
L2 = 78439369068: as L3 on sheet Driver1; ComponentLink1Description: Website Link; ComponentLink1URL: https://www.we-online.com/redexpert/article/78439369068?ad; ComponentLink2Description: Datasheet Link; ComponentLink2URL: https://www.we-online.com/redexpert/spec/78439369068?ad; Manufacturer Part Number: 78439369068; Category: Shielded Power Inductors; Match Code: WE-XHMA; Mount: Surface Mount; Operating Temperature Max: 125°C; Operating Temperature Min: -40°C; Packaging: Tape and Reel; Length: 11.6mm; Width: 10.5mm; Height: 8.8mm; DC Resistance: 7.16mΩ; Inductance: 6.8µH; Rated Current: 10.5A
P8 = Header 2X2: Header, 2-Pin, Dual row; LatestRevisionDate: 17-Jul-2002; LatestRevisionNote: Re-released for DXP Platform.; Publisher: Altium Limited
P9 = Header 5X2: Header, 5-Pin, Dual row; LatestRevisionDate: 17-Jul-2002; LatestRevisionNote: Re-released for DXP Platform.; Publisher: Altium Limited
P10 = Header 4 SMD: Header, 4-Pin; LatestRevisionDate: 17-Jul-2002; LatestRevisionNote: Re-released for DXP Platform.; Publisher: Altium Limited
R10-R17 = Res3: Resistor; Published: 8-Jun-2000; LatestRevisionDate: 29-May-2009; LatestRevisionNote: IPC-7351 Footprint Added.; PackageReference: J1-0603; Publisher: Altium Limited; PackageDescription: Chip Resistor

## Sheet Driver2.SchDoc
size A4; SheetNumber: 4; SheetTotal: 8
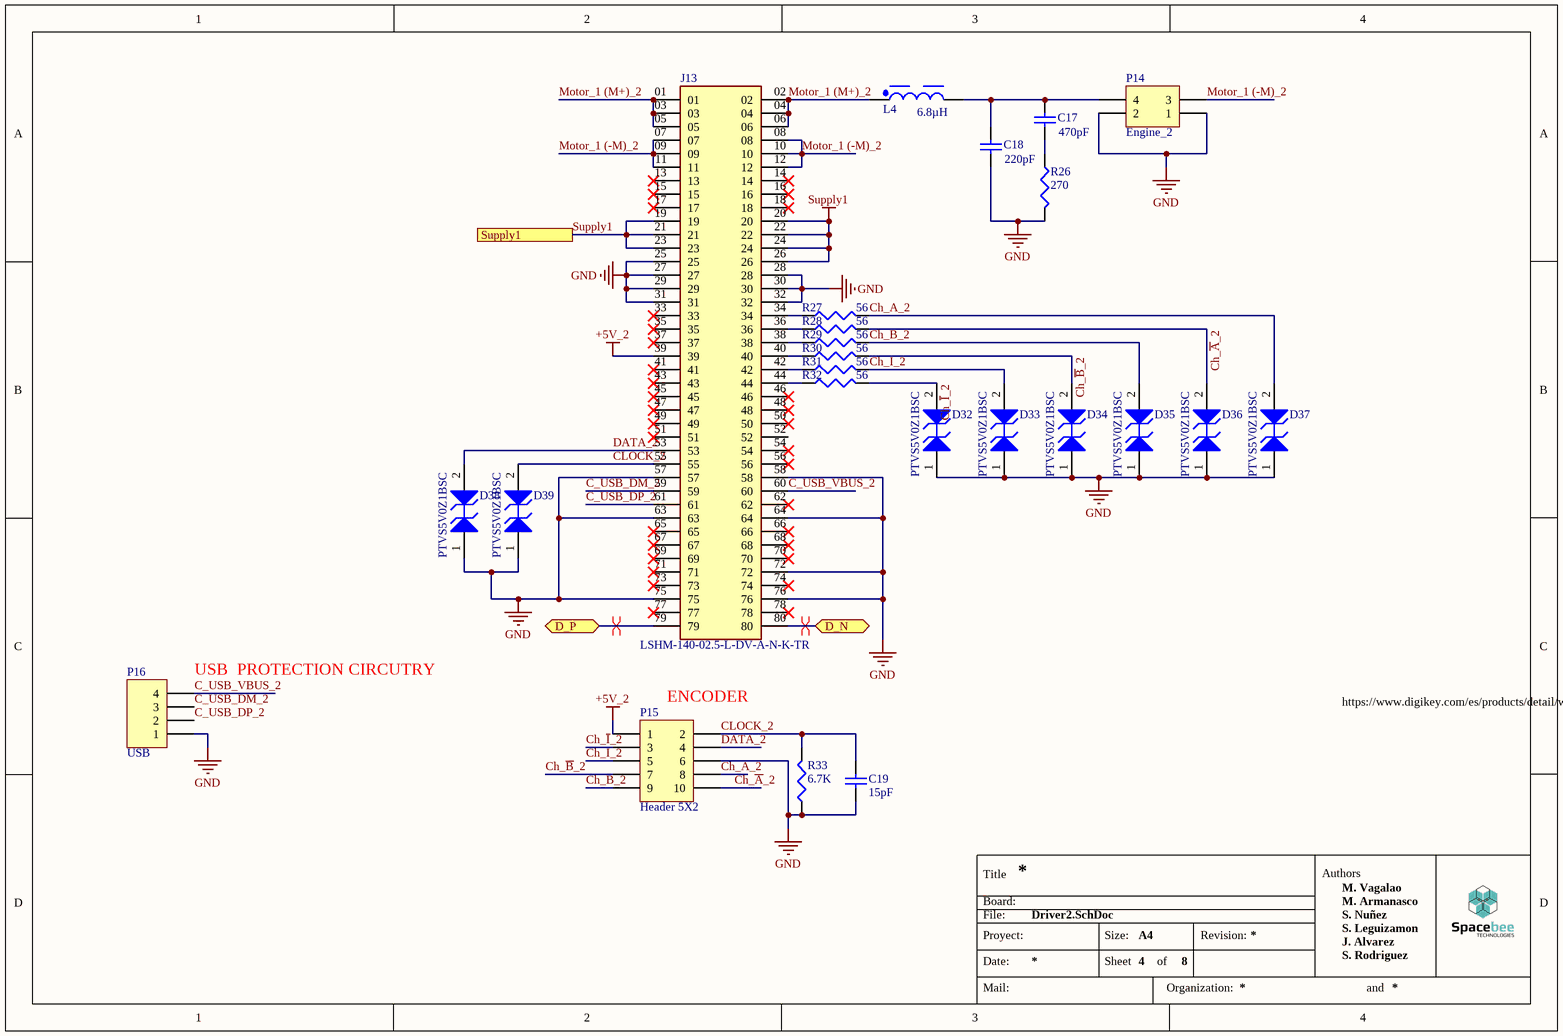
[diagram p5: Driver2.SchDoc]

### Parts
C17  value 470pF  [1608[0603]]  (hidden comment: Cap Semi)
C18  value 220pF  [1608[0603]]  (hidden comment: Cap Semi)
C19  value 15pF  [6-0805_L]  (hidden comment: Cap Semi)
D32  PTVS5V0Z1BSC  [SOD993B]
D33  PTVS5V0Z1BSC  [SOD993B]
D34  PTVS5V0Z1BSC  [SOD993B]
D35  PTVS5V0Z1BSC  [SOD993B]
D36  PTVS5V0Z1BSC  [SOD993B]
D37  PTVS5V0Z1BSC  [SOD993B]
D38  PTVS5V0Z1BSC  [SOD993B]
D39  PTVS5V0Z1BSC  [SOD993B]
J13  LSHM-140-02.5-L-DV-A-N-K-TR  [SAMTEC_LSHM-140-02.5-L-DV-A-N-K-TR]
L4  6.8µH  [WE-XHMA_6060]
P14  Engine_2  [MOLEX_1724480004]
P15  Header 5X2  [CONN_HIF3FC-14PA-2.54DS(71)_HIR]
P16  USB  [Header 4 SMD]
R26  value 270  [J1-0603]  (hidden comment: Res3)
R27  value 56  [J1-0603]  (hidden comment: Res3)
R28  value 56  [J1-0603]  (hidden comment: Res3)
R29  value 56  [J1-0603]  (hidden comment: Res3)
R30  value 56  [J1-0603]  (hidden comment: Res3)
R31  value 56  [J1-0603]  (hidden comment: Res3)
R32  value 56  [J1-0603]  (hidden comment: Res3)
R33  value 6.7K  [J1-0603]  (hidden comment: Res3)

### Ports
D_N (bidir), D_P (bidir), Supply1

### Nets
+5V_2: J13.39 P15.1
GND: C18.2 C19.1 D32.1(A1) D33.1(A1) D34.1(A1) D35.1(A1) D36.1(A1) D37.1(A1) D38.1(A1) D39.1(A1) J13.25 J13.27 J13.28 J13.29 J13.30 J13.31 J13.32 J13.57 J13.58 J13.63 J13.64 J13.72 J13.75 J13.76 P14.1 P14.2 P15.6 P16.1 R26.2 R33.1
Supply1: J13.19 J13.20 J13.21 J13.22 J13.23 J13.24 J13.26 ; port Supply1
C_USB_DM_2: J13.59 P16.3
C_USB_DP_2: J13.61 P16.2
C_USB_VBUS_2: J13.60 P16.4
Ch_~{A}_2: D36.2(A2) P15.10 R28.2
Ch_A_2: D37.2(A2) P15.8 R27.2
Ch_~{B}_2: D34.2(A2) P15.7 R30.2
Ch_B_2: D35.2(A2) P15.9 R29.2
Ch_~{I}_2: D32.2(A2) P15.3 R32.2
Ch_I_2: D33.2(A2) P15.5 R31.2
CLOCK_2: C19.2 D39.2(A2) J13.55 P15.2 R33.2
D_N: J13.80 ; port D_N
D_P: J13.79 ; port D_P
DATA_2: D38.2(A2) J13.53 P15.4
Motor_1 (-M)_2: J13.07 J13.08 J13.09 J13.10 J13.11 J13.12 P14.3
Motor_1 (M+)_2: J13.01 J13.02 J13.03 J13.04 J13.05 J13.06 L4.1
NetC17_1: C17.1 C18.1 L4.2 P14.4
NetC17_2: C17.2 R26.1
NetJ13_34: J13.34 R27.1
NetJ13_36: J13.36 R28.1
NetJ13_38: J13.38 R29.1
NetJ13_40: J13.40 R30.1
NetJ13_42: J13.42 R31.1
NetJ13_44: J13.44 R32.1

Not connected (* = marked no-connect by the designer): J13 13* 14* 15* 16* 17* 18* 33* 35* 37* 41* 43* 45* 46* 47* 48* 49* 50* 51* 52 54* 56* 62* 65* 66* 67* 68* 69* 70* 71* 73* 74* 77* 78*

### Layout directives
differential pair: D_N, D_P

### Notes on the sheet
- (near P16) USB  PROTECTION CIRCUTRY
- (near P15) ENCODER
- https://www.digikey.com/es/products/detail/würth-elektronik/9774050243R/5320640?s=N4IgTCBcDaIJwHYEBYAMBWVZkGYBKIAugL5A
- Title
- Board:
- File:
- Authors
- M. Armanasco
- S. Nuñez
- M. Vagalao
- Proyect:
- Date:
- Mail:
- Size:
- Sheet
- A4
- of
- Organization:
- Revision:
- S. Rodriguez
- S. Leguizamon
- J. Alvarez
- and

### Library data of the parts
C17 C18 = Cap Semi: Capacitor (Semiconductor SIM Model); Published: 8-Jun-2000; LatestRevisionDate: 29-May-2009; LatestRevisionNote: IPC-7351 Footprint Added.; PackageReference: C1206; Publisher: Altium Limited; PackageDescription: Chip Capacitor
C19 = Cap 0805: Capacitor (Semiconductor SIM Model); Published: 8-Jun-2000; LatestRevisionDate: 29-May-2009; LatestRevisionNote: IPC-7351 Footprint Added.; PackageReference: C1206; Publisher: Altium Limited; PackageDescription: Chip Capacitor
D32-D39 = PTVS5V0Z1BSC: as D23 on sheet Driver1; DatasheetVersion: Rev. A; PackageVersion: Rev. A, 01/2000; PackageReference: SMB-2-403C-01; PackageDescription: 2-Pin Small Molded Package, J-Bend Lead, Body 4.315 x 3.555 mm; Supplier 1: Digi-Key; Supplier Part Number 1: 1SMB16CAT3OSTR-ND; Supplier 2: Digi-Key; Supplier Part Number 2: 1SMB16CAT3OSCT-ND; Supplier 3: Digi-Key; Supplier Part Number 3: 1SMB16CAT3OSDKR-ND; Mounting Technology: Surface Mount; ComponentLink1Description: Manufacturer URL; ComponentLink1URL: http://www.onsemi.com/; ComponentLink2Description: Datasheet; ComponentLink2URL: http://www.onsemi.com/pub_link/Collateral/1SMB10CAT3-D.PDF; ComponentLink3Description: Package Specification; ComponentLink3URL: http://www.onsemi.com/pub_link/Collateral/1SMB10CAT3-D.PDF
J13 = LSHM-140-02.5-L-DV-A-N-K-TR: as J11 on sheet Driver1; Price: None; MP: LSHM-140-02.5-L-DV-A-N-K-TR; Availability: Unavailable; Value: *; Package: None
L4 = 78439369068: as L3 on sheet Driver1; ComponentLink1Description: Website Link; ComponentLink1URL: https://www.we-online.com/redexpert/article/78439369068?ad; ComponentLink2Description: Datasheet Link; ComponentLink2URL: https://www.we-online.com/redexpert/spec/78439369068?ad; Manufacturer Part Number: 78439369068; Category: Shielded Power Inductors; Match Code: WE-XHMA; Mount: Surface Mount; Operating Temperature Max: 125°C; Operating Temperature Min: -40°C; Packaging: Tape and Reel; Length: 11.6mm; Width: 10.5mm; Height: 8.8mm; DC Resistance: 7.16mΩ; Inductance: 6.8µH; Rated Current: 10.5A
P14 = Header 2X2: Header, 2-Pin, Dual row; LatestRevisionDate: 17-Jul-2002; LatestRevisionNote: Re-released for DXP Platform.; Publisher: Altium Limited
P15 = Header 5X2: Header, 5-Pin, Dual row; LatestRevisionDate: 17-Jul-2002; LatestRevisionNote: Re-released for DXP Platform.; Publisher: Altium Limited
P16 = Header 4 SMD: Header, 4-Pin; LatestRevisionDate: 17-Jul-2002; LatestRevisionNote: Re-released for DXP Platform.; Publisher: Altium Limited
R26-R33 = Res3: Resistor; Published: 8-Jun-2000; LatestRevisionDate: 29-May-2009; LatestRevisionNote: IPC-7351 Footprint Added.; PackageReference: J1-0603; Publisher: Altium Limited; PackageDescription: Chip Resistor

## Sheet Driver4.SchDoc
size A4; SheetNumber: 6; SheetTotal: 8
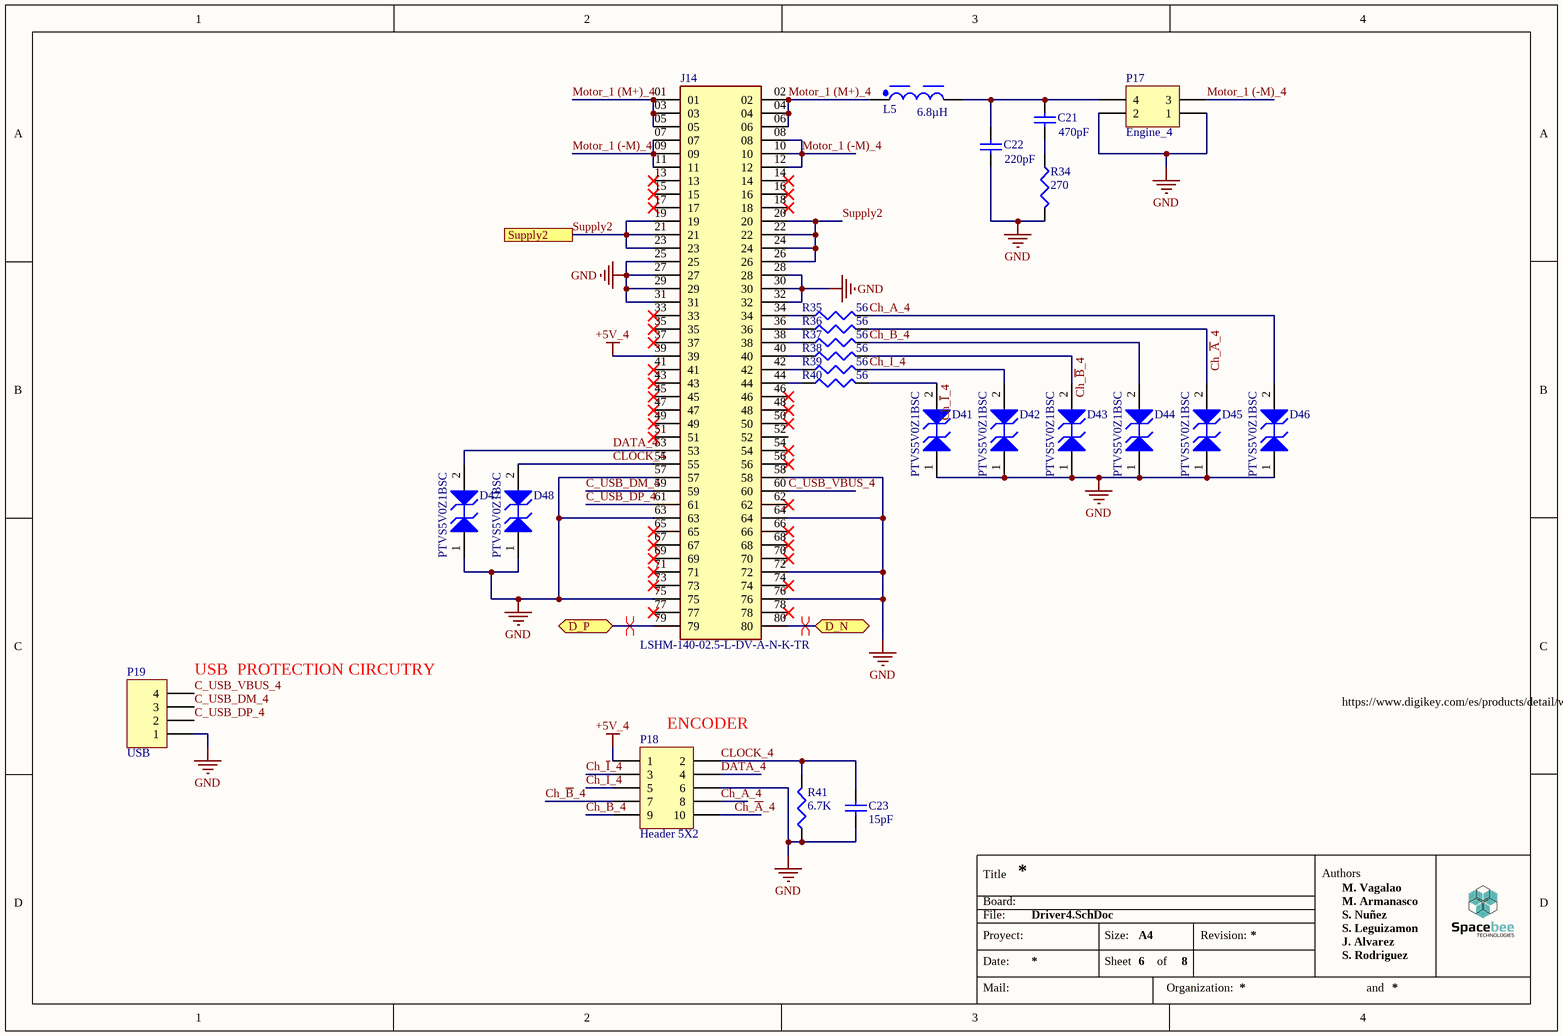
[diagram p6: Driver4.SchDoc]

### Parts
C21  value 470pF  [1608[0603]]  (hidden comment: Cap Semi)
C22  value 220pF  [1608[0603]]  (hidden comment: Cap Semi)
C23  value 15pF  [6-0805_L]  (hidden comment: Cap Semi)
D41  PTVS5V0Z1BSC  [SOD993B]
D42  PTVS5V0Z1BSC  [SOD993B]
D43  PTVS5V0Z1BSC  [SOD993B]
D44  PTVS5V0Z1BSC  [SOD993B]
D45  PTVS5V0Z1BSC  [SOD993B]
D46  PTVS5V0Z1BSC  [SOD993B]
D47  PTVS5V0Z1BSC  [SOD993B]
D48  PTVS5V0Z1BSC  [SOD993B]
J14  LSHM-140-02.5-L-DV-A-N-K-TR  [SAMTEC_LSHM-140-02.5-L-DV-A-N-K-TR]
L5  6.8µH  [WE-XHMA_6060]
P17  Engine_4  [MOLEX_1724480004]
P18  Header 5X2  [CONN_HIF3FC-14PA-2.54DS(71)_HIR]
P19  USB  [Header 4 SMD]
R34  value 270  [J1-0603]  (hidden comment: Res3)
R35  value 56  [J1-0603]  (hidden comment: Res3)
R36  value 56  [J1-0603]  (hidden comment: Res3)
R37  value 56  [J1-0603]  (hidden comment: Res3)
R38  value 56  [J1-0603]  (hidden comment: Res3)
R39  value 56  [J1-0603]  (hidden comment: Res3)
R40  value 56  [J1-0603]  (hidden comment: Res3)
R41  value 6.7K  [J1-0603]  (hidden comment: Res3)

### Ports
D_N (bidir), D_P (bidir), Supply2

### Nets
+5V_4: J14.39 P18.1
GND: C22.2 C23.1 D41.1(A1) D42.1(A1) D43.1(A1) D44.1(A1) D45.1(A1) D46.1(A1) D47.1(A1) D48.1(A1) J14.25 J14.27 J14.28 J14.29 J14.30 J14.31 J14.32 J14.57 J14.58 J14.63 J14.64 J14.72 J14.75 J14.76 P17.1 P17.2 P18.6 P19.1 R34.2 R41.1
C_USB_DM_4: J14.59 P19.3
C_USB_DP_4: J14.61 P19.2
C_USB_VBUS_4: J14.60 P19.4
Ch_~{A}_4: D45.2(A2) P18.10 R36.2
Ch_A_4: D46.2(A2) P18.8 R35.2
Ch_~{B}_4: D43.2(A2) P18.7 R38.2
Ch_B_4: D44.2(A2) P18.9 R37.2
Ch_~{I}_4: D41.2(A2) P18.3 R40.2
Ch_I_4: D42.2(A2) P18.5 R39.2
CLOCK_4: C23.2 D48.2(A2) J14.55 P18.2 R41.2
D_N: J14.80 ; port D_N
D_P: J14.79 ; port D_P
DATA_4: D47.2(A2) J14.53 P18.4
Motor_1 (-M)_4: J14.07 J14.08 J14.09 J14.10 J14.11 J14.12 P17.3
Motor_1 (M+)_4: J14.01 J14.02 J14.03 J14.04 J14.05 J14.06 L5.1
Supply2: J14.19 J14.20 J14.21 J14.22 J14.23 J14.24 J14.26 ; port Supply2
NetC21_1: C21.1 C22.1 L5.2 P17.4
NetC21_2: C21.2 R34.1
NetJ14_34: J14.34 R35.1
NetJ14_36: J14.36 R36.1
NetJ14_38: J14.38 R37.1
NetJ14_40: J14.40 R38.1
NetJ14_42: J14.42 R39.1
NetJ14_44: J14.44 R40.1

Not connected (* = marked no-connect by the designer): J14 13* 14* 15* 16* 17* 18* 33* 35* 37* 41* 43* 45* 46* 47* 48* 49* 50* 51* 52 54* 56* 62* 65* 66* 67* 68* 69* 70* 71* 73* 74* 77* 78*

### Layout directives
differential pair: D_N, D_P

### Notes on the sheet
- (near P19) USB  PROTECTION CIRCUTRY
- (near P18) ENCODER
- https://www.digikey.com/es/products/detail/würth-elektronik/9774050243R/5320640?s=N4IgTCBcDaIJwHYEBYAMBWVZkGYBKIAugL5A
- Title
- Board:
- File:
- Authors
- M. Armanasco
- S. Nuñez
- M. Vagalao
- Proyect:
- Date:
- Mail:
- Size:
- Sheet
- A4
- of
- Organization:
- Revision:
- S. Rodriguez
- S. Leguizamon
- J. Alvarez
- and

### Library data of the parts
C21 C22 = Cap Semi: Capacitor (Semiconductor SIM Model); Published: 8-Jun-2000; LatestRevisionDate: 29-May-2009; LatestRevisionNote: IPC-7351 Footprint Added.; PackageReference: C1206; Publisher: Altium Limited; PackageDescription: Chip Capacitor
C23 = Cap 0805: Capacitor (Semiconductor SIM Model); Published: 8-Jun-2000; LatestRevisionDate: 29-May-2009; LatestRevisionNote: IPC-7351 Footprint Added.; PackageReference: C1206; Publisher: Altium Limited; PackageDescription: Chip Capacitor
D41-D48 = PTVS5V0Z1BSC: as D23 on sheet Driver1; DatasheetVersion: Rev. A; PackageVersion: Rev. A, 01/2000; PackageReference: SMB-2-403C-01; PackageDescription: 2-Pin Small Molded Package, J-Bend Lead, Body 4.315 x 3.555 mm; Supplier 1: Digi-Key; Supplier Part Number 1: 1SMB16CAT3OSTR-ND; Supplier 2: Digi-Key; Supplier Part Number 2: 1SMB16CAT3OSCT-ND; Supplier 3: Digi-Key; Supplier Part Number 3: 1SMB16CAT3OSDKR-ND; Mounting Technology: Surface Mount; ComponentLink1Description: Manufacturer URL; ComponentLink1URL: http://www.onsemi.com/; ComponentLink2Description: Datasheet; ComponentLink2URL: http://www.onsemi.com/pub_link/Collateral/1SMB10CAT3-D.PDF; ComponentLink3Description: Package Specification; ComponentLink3URL: http://www.onsemi.com/pub_link/Collateral/1SMB10CAT3-D.PDF
J14 = LSHM-140-02.5-L-DV-A-N-K-TR: as J11 on sheet Driver1; Price: None; MP: LSHM-140-02.5-L-DV-A-N-K-TR; Availability: Unavailable; Value: *; Package: None
L5 = 78439369068: as L3 on sheet Driver1; ComponentLink1Description: Website Link; ComponentLink1URL: https://www.we-online.com/redexpert/article/78439369068?ad; ComponentLink2Description: Datasheet Link; ComponentLink2URL: https://www.we-online.com/redexpert/spec/78439369068?ad; Manufacturer Part Number: 78439369068; Category: Shielded Power Inductors; Match Code: WE-XHMA; Mount: Surface Mount; Operating Temperature Max: 125°C; Operating Temperature Min: -40°C; Packaging: Tape and Reel; Length: 11.6mm; Width: 10.5mm; Height: 8.8mm; DC Resistance: 7.16mΩ; Inductance: 6.8µH; Rated Current: 10.5A
P17 = Header 2X2: Header, 2-Pin, Dual row; LatestRevisionDate: 17-Jul-2002; LatestRevisionNote: Re-released for DXP Platform.; Publisher: Altium Limited
P18 = Header 5X2: Header, 5-Pin, Dual row; LatestRevisionDate: 17-Jul-2002; LatestRevisionNote: Re-released for DXP Platform.; Publisher: Altium Limited
P19 = Header 4 SMD: Header, 4-Pin; LatestRevisionDate: 17-Jul-2002; LatestRevisionNote: Re-released for DXP Platform.; Publisher: Altium Limited
R34-R41 = Res3: Resistor; Published: 8-Jun-2000; LatestRevisionDate: 29-May-2009; LatestRevisionNote: IPC-7351 Footprint Added.; PackageReference: J1-0603; Publisher: Altium Limited; PackageDescription: Chip Resistor

## Sheet Driver6.SchDoc
size A4; SheetNumber: 8; SheetTotal: 8
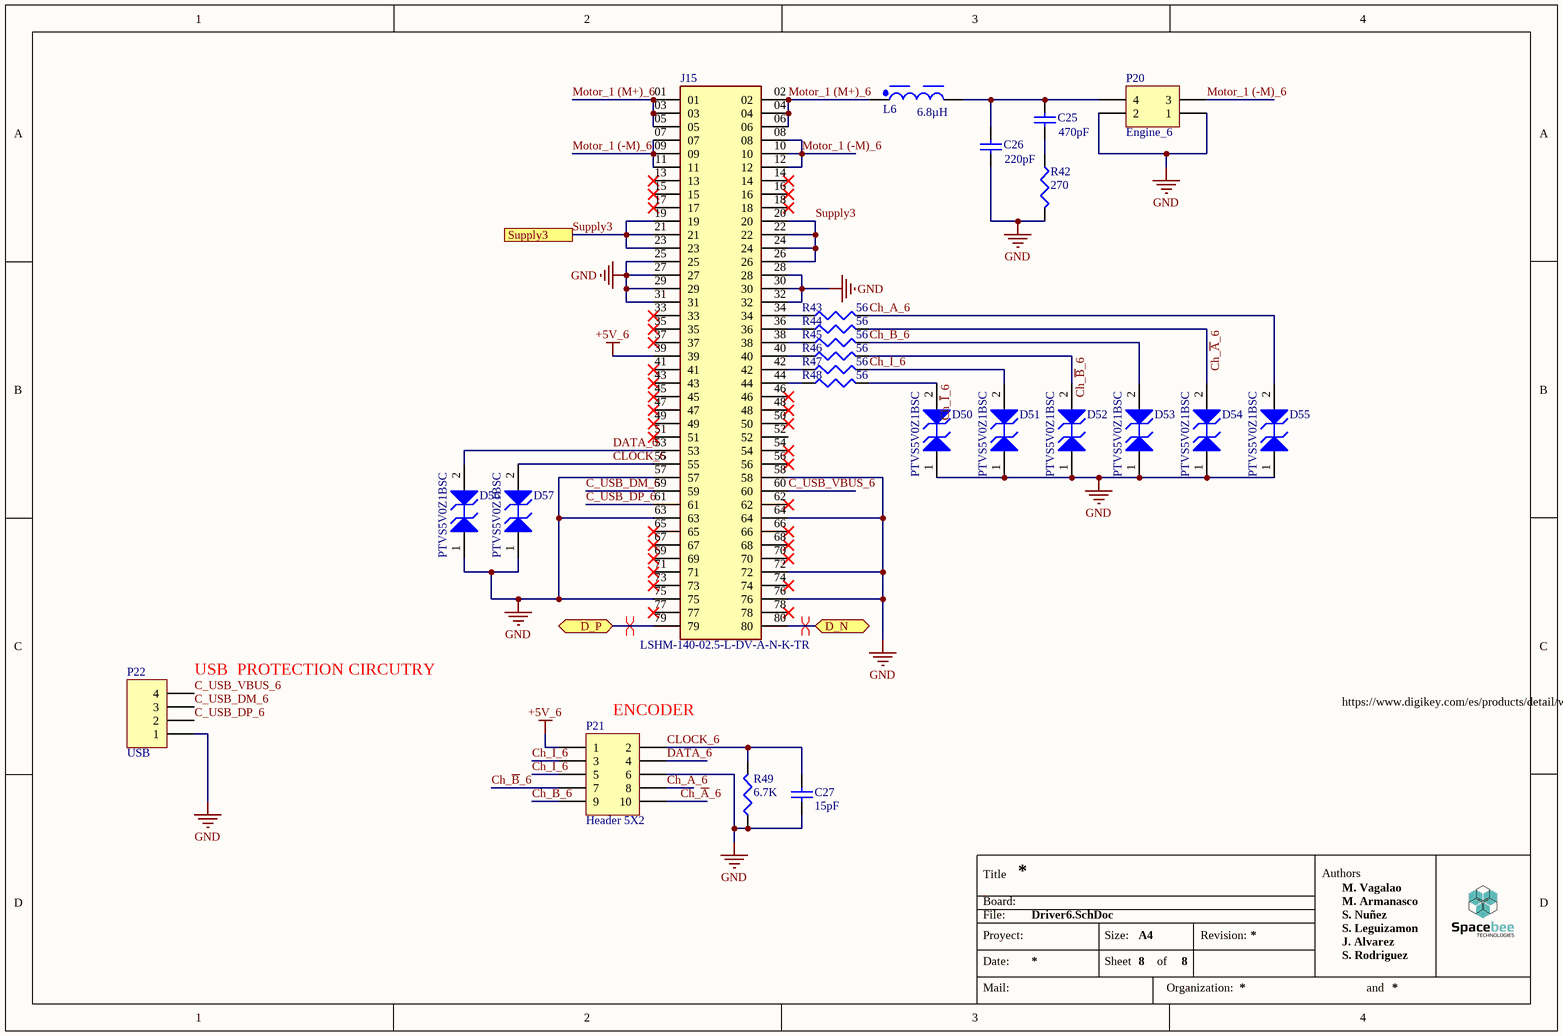
[diagram p7: Driver6.SchDoc]

### Parts
C25  value 470pF  [1608[0603]]  (hidden comment: Cap Semi)
C26  value 220pF  [1608[0603]]  (hidden comment: Cap Semi)
C27  value 15pF  [6-0805_L]  (hidden comment: Cap Semi)
D50  PTVS5V0Z1BSC  [SOD993B]
D51  PTVS5V0Z1BSC  [SOD993B]
D52  PTVS5V0Z1BSC  [SOD993B]
D53  PTVS5V0Z1BSC  [SOD993B]
D54  PTVS5V0Z1BSC  [SOD993B]
D55  PTVS5V0Z1BSC  [SOD993B]
D56  PTVS5V0Z1BSC  [SOD993B]
D57  PTVS5V0Z1BSC  [SOD993B]
J15  LSHM-140-02.5-L-DV-A-N-K-TR  [SAMTEC_LSHM-140-02.5-L-DV-A-N-K-TR]
L6  6.8µH  [WE-XHMA_6060]
P20  Engine_6  [MOLEX_1724480004]
P21  Header 5X2  [CONN_HIF3FC-14PA-2.54DS(71)_HIR]
P22  USB  [Header 4 SMD]
R42  value 270  [J1-0603]  (hidden comment: Res3)
R43  value 56  [J1-0603]  (hidden comment: Res3)
R44  value 56  [J1-0603]  (hidden comment: Res3)
R45  value 56  [J1-0603]  (hidden comment: Res3)
R46  value 56  [J1-0603]  (hidden comment: Res3)
R47  value 56  [J1-0603]  (hidden comment: Res3)
R48  value 56  [J1-0603]  (hidden comment: Res3)
R49  value 6.7K  [J1-0603]  (hidden comment: Res3)

### Ports
D_N (bidir), D_P (bidir), Supply3

### Nets
+5V_6: J15.39 P21.1
GND: C26.2 C27.1 D50.1(A1) D51.1(A1) D52.1(A1) D53.1(A1) D54.1(A1) D55.1(A1) D56.1(A1) D57.1(A1) J15.25 J15.27 J15.28 J15.29 J15.30 J15.31 J15.32 J15.57 J15.58 J15.63 J15.64 J15.72 J15.75 J15.76 P20.1 P20.2 P21.6 P22.1 R42.2 R49.1
C_USB_DM_6: J15.59 P22.3
C_USB_DP_6: J15.61 P22.2
C_USB_VBUS_6: J15.60 P22.4
Ch_~{A}_6: D54.2(A2) P21.10 R44.2
Ch_A_6: D55.2(A2) P21.8 R43.2
Ch_~{B}_6: D52.2(A2) P21.7 R46.2
Ch_B_6: D53.2(A2) P21.9 R45.2
Ch_~{I}_6: D50.2(A2) P21.3 R48.2
Ch_I_6: D51.2(A2) P21.5 R47.2
CLOCK_6: C27.2 D57.2(A2) J15.55 P21.2 R49.2
D_N: J15.80 ; port D_N
D_P: J15.79 ; port D_P
DATA_6: D56.2(A2) J15.53 P21.4
Motor_1 (-M)_6: J15.07 J15.08 J15.09 J15.10 J15.11 J15.12 P20.3
Motor_1 (M+)_6: J15.01 J15.02 J15.03 J15.04 J15.05 J15.06 L6.1
Supply3: J15.19 J15.20 J15.21 J15.22 J15.23 J15.24 J15.26 ; port Supply3
NetC25_1: C25.1 C26.1 L6.2 P20.4
NetC25_2: C25.2 R42.1
NetJ15_34: J15.34 R43.1
NetJ15_36: J15.36 R44.1
NetJ15_38: J15.38 R45.1
NetJ15_40: J15.40 R46.1
NetJ15_42: J15.42 R47.1
NetJ15_44: J15.44 R48.1

Not connected (* = marked no-connect by the designer): J15 13* 14* 15* 16* 17* 18* 33* 35* 37* 41* 43* 45* 46* 47* 48* 49* 50* 51* 52 54* 56* 62* 65* 66* 67* 68* 69* 70* 71* 73* 74* 77* 78*

### Layout directives
differential pair: D_N, D_P

### Notes on the sheet
- (near P22) USB  PROTECTION CIRCUTRY
- (near P21) ENCODER
- https://www.digikey.com/es/products/detail/würth-elektronik/9774050243R/5320640?s=N4IgTCBcDaIJwHYEBYAMBWVZkGYBKIAugL5A
- Title
- Board:
- File:
- Authors
- M. Armanasco
- S. Nuñez
- M. Vagalao
- Proyect:
- Date:
- Mail:
- Size:
- Sheet
- A4
- of
- Organization:
- Revision:
- S. Rodriguez
- S. Leguizamon
- J. Alvarez
- and

### Library data of the parts
C25 C26 = Cap Semi: Capacitor (Semiconductor SIM Model); Published: 8-Jun-2000; LatestRevisionDate: 29-May-2009; LatestRevisionNote: IPC-7351 Footprint Added.; PackageReference: C1206; Publisher: Altium Limited; PackageDescription: Chip Capacitor
C27 = Cap 0805: Capacitor (Semiconductor SIM Model); Published: 8-Jun-2000; LatestRevisionDate: 29-May-2009; LatestRevisionNote: IPC-7351 Footprint Added.; PackageReference: C1206; Publisher: Altium Limited; PackageDescription: Chip Capacitor
D50-D57 = PTVS5V0Z1BSC: as D23 on sheet Driver1; DatasheetVersion: Rev. A; PackageVersion: Rev. A, 01/2000; PackageReference: SMB-2-403C-01; PackageDescription: 2-Pin Small Molded Package, J-Bend Lead, Body 4.315 x 3.555 mm; Supplier 1: Digi-Key; Supplier Part Number 1: 1SMB16CAT3OSTR-ND; Supplier 2: Digi-Key; Supplier Part Number 2: 1SMB16CAT3OSCT-ND; Supplier 3: Digi-Key; Supplier Part Number 3: 1SMB16CAT3OSDKR-ND; Mounting Technology: Surface Mount; ComponentLink1Description: Manufacturer URL; ComponentLink1URL: http://www.onsemi.com/; ComponentLink2Description: Datasheet; ComponentLink2URL: http://www.onsemi.com/pub_link/Collateral/1SMB10CAT3-D.PDF; ComponentLink3Description: Package Specification; ComponentLink3URL: http://www.onsemi.com/pub_link/Collateral/1SMB10CAT3-D.PDF
J15 = LSHM-140-02.5-L-DV-A-N-K-TR: as J11 on sheet Driver1; Price: None; MP: LSHM-140-02.5-L-DV-A-N-K-TR; Availability: Unavailable; Value: *; Package: None
L6 = 78439369068: as L3 on sheet Driver1; ComponentLink1Description: Website Link; ComponentLink1URL: https://www.we-online.com/redexpert/article/78439369068?ad; ComponentLink2Description: Datasheet Link; ComponentLink2URL: https://www.we-online.com/redexpert/spec/78439369068?ad; Manufacturer Part Number: 78439369068; Category: Shielded Power Inductors; Match Code: WE-XHMA; Mount: Surface Mount; Operating Temperature Max: 125°C; Operating Temperature Min: -40°C; Packaging: Tape and Reel; Length: 11.6mm; Width: 10.5mm; Height: 8.8mm; DC Resistance: 7.16mΩ; Inductance: 6.8µH; Rated Current: 10.5A
P20 = Header 2X2: Header, 2-Pin, Dual row; LatestRevisionDate: 17-Jul-2002; LatestRevisionNote: Re-released for DXP Platform.; Publisher: Altium Limited
P21 = Header 5X2: Header, 5-Pin, Dual row; LatestRevisionDate: 17-Jul-2002; LatestRevisionNote: Re-released for DXP Platform.; Publisher: Altium Limited
P22 = Header 4 SMD: Header, 4-Pin; LatestRevisionDate: 17-Jul-2002; LatestRevisionNote: Re-released for DXP Platform.; Publisher: Altium Limited
R42-R49 = Res3: Resistor; Published: 8-Jun-2000; LatestRevisionDate: 29-May-2009; LatestRevisionNote: IPC-7351 Footprint Added.; PackageReference: J1-0603; Publisher: Altium Limited; PackageDescription: Chip Resistor

## Nets that join several sheets
GND: TopDrivers (10 pins), DriversBoard (13 pins), Driver1 (30 pins), Driver3 (30 pins), Driver5 (30 pins), Driver2 (30 pins), Driver4 (30 pins), Driver6 (30 pins)
Supply1: TopDrivers (C1.1 D1.1 F1.2), Driver1 (7 pins), Driver2 (7 pins)
D_N: TopDrivers (P4.3 R1.1), Driver1 (J11.80), Driver3 (J9.80), Driver5 (J10.80), Driver2 (J13.80), Driver4 (J14.80), Driver6 (J15.80)
D_P: TopDrivers (P4.4 R1.2), Driver1 (J11.79), Driver3 (J9.79), Driver5 (J10.79), Driver2 (J13.79), Driver4 (J14.79), Driver6 (J15.79)
Supply2: TopDrivers (P2.2), Driver3 (7 pins), Driver4 (7 pins)
Supply3: TopDrivers (C3.1 D3.1 F3.2), Driver5 (7 pins), Driver6 (7 pins)